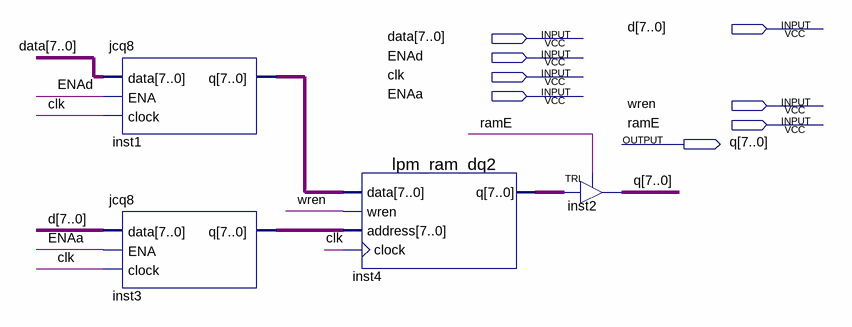
[diagram p0: schematic sheet]
// Quartus schematic dram.bdf as structural Verilog: 4 symbols, 8 pins
module dram (
  input  [7:0] d,
  input  [7:0] data,
  input  ENAd,
  input  clk,
  input  ENAa,
  input  wren,
  input  ramE,
  output [7:0] q
);

  wire [7:0] inst1_q, inst3_q, inst4_q;

  jcq8 inst1 (.data(data), .ENA(ENAd), .clock(clk), .q(inst1_q));
  jcq8 inst3 (.data(d), .ENA(ENAa), .clock(clk), .q(inst3_q));
  lpm_ram_dq2 inst4 (.data(inst1_q), .wren(wren), .address(inst3_q), .clock(clk), .q(inst4_q));
  TRI inst2[7:0] (.IN(inst4_q), .OE(ramE), .OUT(q));
endmodule
